# Altium schematic sheet S29GL064N90TFI04.SchDoc
size A
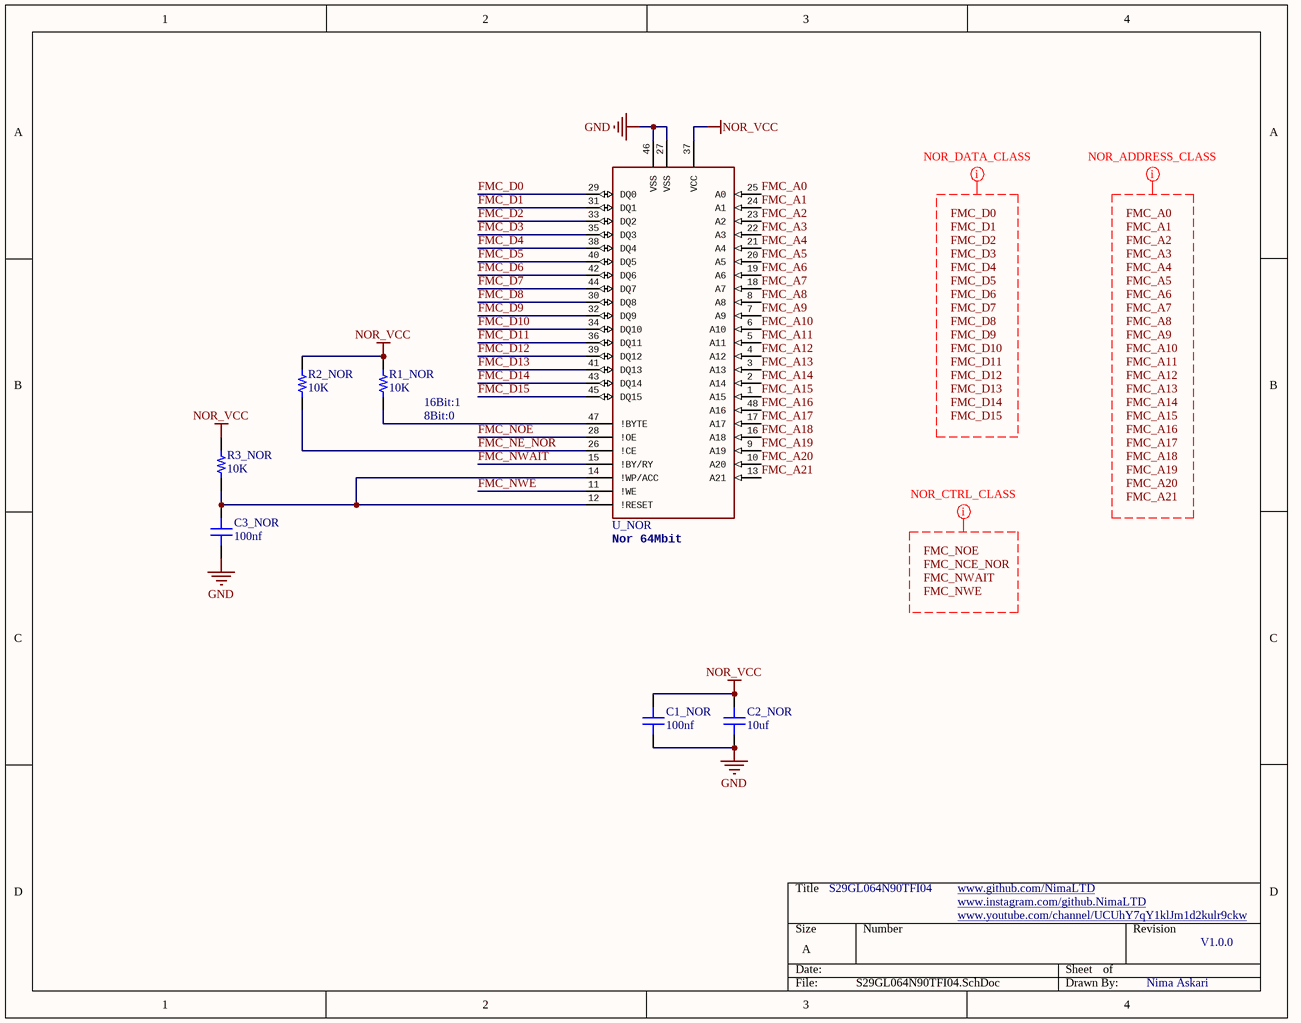
[diagram p0: S29GL064N90TFI04.SchDoc]

## Parts
C1_NOR  100nf  [CAP 0805]
C2_NOR  10uf  [CAP 0805]
C3_NOR  100nf  [CAP 0805]
R1_NOR  10K  [RES 0805]
R2_NOR  10K  [RES 0805]
R3_NOR  10K  [RES 0805]
U_NOR  Nor 64Mbit  [TSOP48]

## Nets
GND: C1_NOR.1 C2_NOR.1 C3_NOR.1 U_NOR.27(VSS) U_NOR.46(VSS)
NOR_VCC: C1_NOR.2 C2_NOR.2 R1_NOR.2 R2_NOR.2 R3_NOR.2 U_NOR.37(VCC)
FMC_A0: U_NOR.25(A0)
FMC_A1: U_NOR.24(A1)
FMC_A2: U_NOR.23(A2)
FMC_A3: U_NOR.22(A3)
FMC_A4: U_NOR.21(A4)
FMC_A5: U_NOR.20(A5)
FMC_A6: U_NOR.19(A6)
FMC_A7: U_NOR.18(A7)
FMC_A8: U_NOR.8(A8)
FMC_A9: U_NOR.7(A9)
FMC_A10: U_NOR.6(A10)
FMC_A11: U_NOR.5(A11)
FMC_A12: U_NOR.4(A12)
FMC_A13: U_NOR.3(A13)
FMC_A14: U_NOR.2(A14)
FMC_A15: U_NOR.1(A15)
FMC_A16: U_NOR.48(A16)
FMC_A17: U_NOR.17(A17)
FMC_A18: U_NOR.16(A18)
FMC_A19: U_NOR.9(A19)
FMC_A20: U_NOR.10(A20)
FMC_A21: U_NOR.13(A21)
FMC_D0: U_NOR.29(DQ0)
FMC_D1: U_NOR.31(DQ1)
FMC_D2: U_NOR.33(DQ2)
FMC_D3: U_NOR.35(DQ3)
FMC_D4: U_NOR.38(DQ4)
FMC_D5: U_NOR.40(DQ5)
FMC_D6: U_NOR.42(DQ6)
FMC_D7: U_NOR.44(DQ7)
FMC_D8: U_NOR.30(DQ8)
FMC_D9: U_NOR.32(DQ9)
FMC_D10: U_NOR.34(DQ10)
FMC_D11: U_NOR.36(DQ11)
FMC_D12: U_NOR.39(DQ12)
FMC_D13: U_NOR.41(DQ13)
FMC_D14: U_NOR.43(DQ14)
FMC_D15: U_NOR.45(DQ15)
FMC_NE_NOR: R2_NOR.1 U_NOR.26(!CE)
FMC_NOE: U_NOR.28(!OE)
FMC_NWAIT: U_NOR.15(!BY/RY)
FMC_NWE: U_NOR.11(!WE)
NetC3_NOR_2: C3_NOR.2 R3_NOR.1 U_NOR.12(!RESET) U_NOR.14(!WP/ACC)
NetR1_NOR_1: R1_NOR.1 U_NOR.47(!BYTE)

## Layout directives
net class NOR_ADDRESS_CLASS; rule Matched Net Lengths [Tolerance = 0.2mm]: FMC_A0, FMC_A1, FMC_A2, FMC_A3, FMC_A4, FMC_A5, FMC_A6, FMC_A7, FMC_A8, FMC_A9, FMC_A10, FMC_A11, FMC_A12, FMC_A13, FMC_A14, FMC_A15, FMC_A16, FMC_A17, FMC_A18, FMC_A19, FMC_A20, FMC_A21
net class NOR_DATA_CLASS; rule Matched Net Lengths [Tolerance = 0.2mm]: FMC_D0, FMC_D1, FMC_D2, FMC_D3, FMC_D4, FMC_D5, FMC_D6, FMC_D7, FMC_D8, FMC_D9, FMC_D10, FMC_D11, FMC_D12, FMC_D13, FMC_D14, FMC_D15
net class NOR_CTRL_CLASS; rule Matched Net Lengths [Tolerance = 0.2mm]: FMC_NCE_NOR, FMC_NOE, FMC_NWAIT, FMC_NWE

## Notes on the sheet
- (near R1_NOR) 16Bit:1
- (near R1_NOR) 8Bit:0
- S29GL064N90TFI04
- www.github.com/NimaLTD <http://www.github.com/NimaLTD>
- www.instagram.com/github.NimaLTD <http://www.instagram.com/github.NimaLTD>
- www.youtube.com/channel/UCUhY7qY1klJm1d2kulr9ckw <http://www.youtube.com/channel/UCUhY7qY1klJm1d2kulr9ckw>
- V1.0.0
- Nima Askari
- Labels drawn without touching a wire or pin: FMC_A0, FMC_A1, FMC_A2, FMC_A3, FMC_A4, FMC_A5, FMC_A6, FMC_A7, FMC_A8, FMC_A9, FMC_A10, FMC_A11, FMC_A12, FMC_A13, FMC_A14, FMC_A15, FMC_A16, FMC_A17, FMC_A18, FMC_A19, FMC_A20, FMC_A21, FMC_D0, FMC_D1, FMC_D2, FMC_D3, FMC_D4, FMC_D5, FMC_D6, FMC_D7, FMC_D8, FMC_D9, FMC_D10, FMC_D11, FMC_D12, FMC_D13, FMC_D14, FMC_D15, FMC_NCE_NOR, FMC_NOE, FMC_NWAIT, FMC_NWE

## Library data of the parts
C1_NOR C2_NOR C3_NOR = Cap SMD 0805: SMT Capacitor
  C1_NOR C3_NOR: Value: 100nf
  C2_NOR: Value: 10uf
R1_NOR R2_NOR R3_NOR = Res SMD 0805: SMD Resistor; Value: 10K
U_NOR = S29GL064N90TFI04